# Altium schematic sheet Power.SchDoc
size A; SheetNumber: 3; SheetTotal: 11
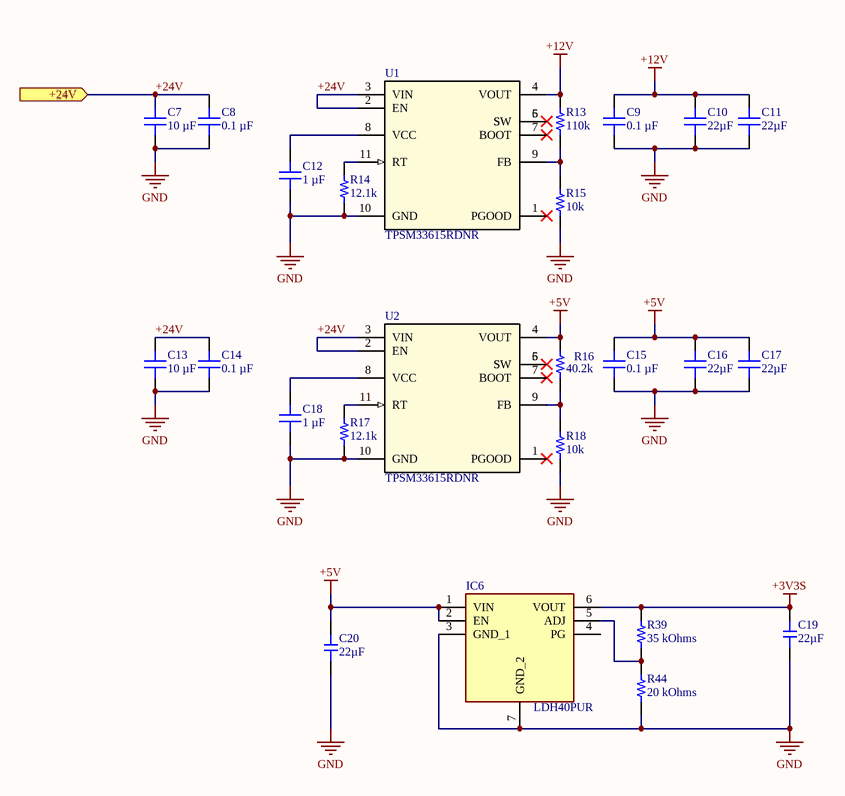
[diagram p0: Power.SchDoc]

## Parts
C7  10 µF  [CAP 1210_3225 - 1MM]
C8  0.1 µF  [CAP 0402_1005]
C9  0.1 µF  [CAP 0402_1005]
C10  22µF  [CAP 1210_3225 - 2.8MM]
C11  22µF  [CAP 1210_3225 - 2.8MM]
C12  1 µF  [CAP 0402_1005]
C13  10 µF  [CAP 1210_3225 - 1MM]
C14  0.1 µF  [CAP 0402_1005]
C15  0.1 µF  [CAP 0402_1005]
C16  22µF  [CAP 1210_3225 - 2.8MM]
C17  22µF  [CAP 1210_3225 - 2.8MM]
C18  1 µF  [CAP 0402_1005]
C19  value 22µF  [CAP-0603]  (hidden comment: CL10A226MQ8NRNC)
C20  value 22µF  [CAP-0603]  (hidden comment: CL10A226MQ8NRNC)
IC6  LDH40PUR  [SON65P200X200X80-7N]
R13  110k  [RES 0402_1005]
R14  12.1k  [RES 0402_1005]
R15  10k  [RES 0402_1005]
R16  40.2k  [RES 0402_1005]
R17  12.1k  [RES 0402_1005]
R18  10k  [RES 0402_1005]
R39  35 kOhms  [RES 0402_1005]
R44  20 kOhms  [RES 0402_1005]
U1  TPSM33615RDNR  [RDN0011A-MFG]
U2  TPSM33615RDNR  [RDN0011A-MFG]

## Ports
+24V (in)

## Nets
+3V3S: C19.2 IC6.6(VOUT) R39.1
+5V: C15.2 C16.2 C17.2 C20.2 IC6.1(VIN) IC6.2(EN) R16.1 U2.4(VOUT)
+12V: C9.2 C10.2 C11.2 R13.1 U1.4(VOUT)
GND: C7.1 C8.1 C9.1 C10.1 C11.1 C12.1 C13.1 C14.1 C15.1 C16.1 C17.1 C18.1 C19.1 C20.1 IC6.3(GND_1) IC6.7(GND_2) R14.2 R15.2 R17.2 R18.2 R44.2 U1.10(GND) U2.10(GND)
+24V: C7.2 C8.2 C13.2 C14.2 U1.2(EN) U1.3(VIN) U2.2(EN) U2.3(VIN) ; port +24V
NetC12_2: C12.2 U1.8(VCC)
NetC18_2: C18.2 U2.8(VCC)
NetIC6_5: IC6.5(ADJ) R39.2 R44.1
NetR13_2: R13.2 R15.1 U1.9(FB)
NetR14_1: R14.1 U1.11(RT)
NetR16_2: R16.2 R18.1 U2.9(FB)
NetR17_1: R17.1 U2.11(RT)
NetU1_5: U1.5(SW) U1.6(SW)
NetU2_5: U2.5(SW) U2.6(SW)

Not connected (* = marked no-connect by the designer): IC6 4(PG); U1 1(PGOOD)* 7(BOOT)*; U2 1(PGOOD)* 7(BOOT)*

## Library data of the parts
C7 C13 = GCJ32EC71H106KA01L: CAP CER 10UF 50V X7S 1210; manufacturer: Murata Electronics; Tolerance: ±10%; Part Number: GCJ32EC71H106KA01L; Value: 10 µF; Applications: Automotive, Boardflex Sensitive; Capacitance: 10 µF; componentlink1description: Datasheet; componentlink1url: https://search.murata.co.jp/Ceramy/image/img/A01X/G101/ENG/GCJ32EC71H106KA01-01.pdf; componentlink2description: DigiKey Link; componentlink2url: https://www.digikey.com/en/products/detail/murata-electronics/GCJ32EC71H106KA01L/6606047; Device Package: 1210 (3225 Metric); Features: Soft Termination; lastupdated: 6/4/2024 7:21:07 PM; Lifecycle Status: Active; Minimum Order: 1; Mounting Type: Surface Mount, MLCC; Operating Temperature: -55°C ~ 125°C; Package / Case: 1210 (3225 Metric); packaging: TapeAndReel; partid: 23622; Part Status: Active; price: 0.32; Ratings: AEC-Q200; series: GCJ; Size / Dimension: 0.126" L x 0.098" W (3.20mm x 2.50mm); Supplier 1: DigiKey; Supplier Part Number 1: 490-14418-1-ND; Temperature Coefficient: X7S; Thickness (Max): 0.110" (2.80mm); Voltage - Rated: 50V
C8 C9 C14 C15 = C0402C104K4RECAUTO: CAP CER 0402 0.1UF 16V X7R 10%; manufacturer: KEMET; Part Number: C0402C104K4RECAUTO; Capacitance: 0.1 µF; Applications: Automotive, ESD Protection; componentlink1description: Datasheet; componentlink1url: https://api.kemet.com/component-edge/download/datasheet/C0402C104K4RECAUTO.pdf; componentlink2description: DigiKey Link; componentlink2url: https://www.digikey.com/en/products/detail/kemet/C0402C104K4RECAUTO/8563695; Device Package: 0402 (1005 Metric); lastupdated: 2/9/2024 8:04:38 PM; Lifecycle Status: Active; Minimum Order: 1; Mounting Type: Surface Mount, MLCC; Operating Temperature: -55°C ~ 125°C; Package / Case: 0402 (1005 Metric); packaging: TapeAndReel; partid: 1731; Part Status: Active; price: 0.01; Ratings: AEC-Q200; series: ESD SMD Auto X7R; Size / Dimension: 0.039" L x 0.020" W (1.00mm x 0.50mm); Supplier 1: DigiKey; Supplier Part Number 1: 399-17167-1-ND; Temperature Coefficient: X7R; Thickness (Max): 0.022" (0.55mm); Tolerance: ±10%; value: 0.1 µF; Voltage - Rated: 16V
C10 C11 C16 C17 = 12103D226MAT2A: CAP CER 22UF 25V X5R 1210; manufacturer: AVX Corporation; Tolerance: ±20%; Part Number: 12103D226MAT2A; Value: 22µF; Applications: General Purpose; Capacitance: 22µF; componentlink1description: Datasheet; componentlink1url: http://datasheets.avx.com/cx5r.pdf; componentlink2description: DigiKey Link; componentlink2url: http://digikey.com/product-detail/en/avx-corporation/12103D226MAT2A/478-5045-1-ND/1888256; Device Package: 1210 (3225 Metric); lastupdated: 9/2/2020 1:10:51 AM; Lifecycle Status: Active; Minimum Order: 1; Mounting Type: Surface Mount, MLCC; Operating Temperature: -55°C ~ 85°C; Package / Case: 1210 (3225 Metric); packaging: TapeAndReel; partid: 23827; Part Status: Active; price: 0.32; series: -; Size / Dimension: 0.126" L x 0.098" W (3.20mm x 2.50mm); Supplier 1: DigiKey; Supplier Part Number 1: 478-5045-1-ND; Temperature Coefficient: X5R; Thickness (Max): 0.110" (2.79mm); Voltage - Rated: 25V
C12 C18 = CL05A105KO5NNNC: CAP CER 1UF 16V X5R 0402; Part Number: C29266; manufacturer: Samsung Electro-Mechanics; Tolerance: ±10%; Capacitance: 1 µF; Applications: General Purpose; componentlink1description: Datasheet; componentlink1url: http://www.samsungsem.com/kr/support/product-search/mlcc/CL05A105KO5NNNC.jsp; componentlink2description: DigiKey Link; componentlink2url: https://www.digikey.com/en/products/detail/samsung-electro-mechanics/CL05A105KO5NNNC/3886725; Device Package: 0402 (1005 Metric); lastupdated: 2/9/2024 8:04:35 PM; Lifecycle Status: Active; Minimum Order: 1; Mounting Type: Surface Mount, MLCC; Operating Temperature: -55°C ~ 85°C; Package / Case: 0402 (1005 Metric); packaging: TapeAndReel; partid: 3120; Part Status: Active; price: 0.01; series: CL; Size / Dimension: 0.039" L x 0.020" W (1.00mm x 0.50mm); Supplier 1: DigiKey; Supplier Part Number 1: 1276-1067-1-ND; Temperature Coefficient: X5R; Thickness (Max): 0.022" (0.55mm); value: 1 µF; Voltage - Rated: 16V
C19 C20 = CMP-001-00651-2: Capacitor, Ceramic (MLCC), 22uF, ±20%, 6.3V, X5R, ±20%, SMD 0603; Manufacturer: Samsung Electro-Mechanics; Impedance (0V Bias) @ 10kHz: 1.09Ω; Capacitance @ 1V DC Bias: 17.820uF; Capacitance @ 3.3V DC Bias: 8.834uF; Impedance (0V Bias) @ 500MHz: 0.428Ω; Impedance (0V Bias) @ 1kHz: 10.5Ω; Impedance (0V Bias) @ 500kHz: 0.0212Ω; Capacitance @ 1.8V DC Bias: 14.074uF; Impedance (0V Bias) @ 1MHz: 0.00751Ω; Impedance (0V Bias) @ 5kHz: 2.16Ω; Capacitance @ 1.5V DC Bias: 15.472uF; Impedance (0V Bias) @ 100MHz: 0.12Ω; Impedance (0V Bias) @ 100Hz: 100Ω; Impedance (0V Bias) @ 50kHz: 0.224Ω; Impedance (0V Bias) @ 5MHz: 0.0137Ω; Capacitance @ 5V DC Bias: 5.741uF; Impedance (0V Bias) @ 500Hz: 20.7Ω; Impedance (0V Bias) @ 5GHz: 3.43Ω; Capacitance @ 1.35V DC Bias: 16.197uF; Impedance (0V Bias) @ 10MHz: 0.0217Ω; Impedance (0V Bias) @ 2GHz: 1.72Ω; Capacitance @ 2.5V DC Bias: 11.369uF; Impedance (0V Bias) @ 50MHz: 0.0716Ω; Capacitance @ 1.2V DC Bias: 16.916uF; Impedance (0V Bias) @ 100kHz: 0.113Ω; Capacitance @ 4.2V DC Bias: 6.952uF; Capacitance @ 3.7V DC Bias: 7.897uF; Impedance (0V Bias) @ 1GHz: 0.751Ω; Temperature Rating: -55°C ~ 85°C; JLCPCB Basic Part: Yes; Temperature Coefficient: X5R; Tolerance: 20%; ComponentLink2Description: JLCPCB Part URL; ComponentLink1URL: https://wmsc.lcsc.com/wmsc/upload/file/pdf/v2/lcsc/2304140030_Samsung-Electro-Mechanics-CL10A226MQ8NRNC_C59461.pdf; ComponentLink4Description: Samsung Component Library; RoHS: Yes; Voltage Rating: 6.3V; ComponentLink4URL: https://weblib.samsungsem.com/mlcc/mlcc-ec.do?partNumber=CL10A226MQ8NRN; ComponentLink3Description: LCSC Part URL; ComponentLink2URL: https://jlcpcb.com/partdetail/C59461; Case/Package: 0603; Manufacturer Part Number: CL10A226MQ8NRNC; ComponentLink1Description: Datasheet; JLCPCB Part Number: C59461; ComponentLink3URL: https://lcsc.com/product-detail/Multilayer-Ceramic-Capacitors-MLCC---SMD-SMT_Samsung-Electro-Mechanics-Samsung-Electro-Mechanics-CL10A226MQ8NRNC_C59461.html; Design Item ID: CL10A226MQ8NRNC; Category: Capacitors - MLCC; Source: jlcpcb_2025_04_capacitors_basic.schlib
IC6 = LDH40PUR: Integrated Circuit; Manufacturer_Name: STMicroelectronics; Datasheet Link: https://www.st.com/resource/en/datasheet/ldh40.pdf; Height: 0.8mm; Manufacturer_Part_Number: LDH40PUR
R13 R16 = RQ73C1E10K5BTD: RES 10.5 KOHMS 0.1% 1/16W 0402; Part Number: C166559; Manufacturer: TE Connectivity Passive Product; Power (Watts): 0.063W, 1/16W; Resistance: 50k; Temperature Coefficient: ±10ppm/°C; ComponentLink1Description: Datasheet; ComponentLink1URL: //media.digikey.com/pdf/Data%20Sheets/Tyco%20Electronics%20P%20B%20PDFs/RQ73-0618%20v2.pdf; ComponentLink2Description: DigiKey Link; ComponentLink2URL: https://www.digikey.com/en/products/detail/te-connectivity-passive-product/RQ73C1E10K5BTD/9479898; Composition: Thin Film; Device Package: 0402 (1005 Metric); Features: Anti-Sulfur, Automotive AEC-Q200; Height - Seated (Max): 0.016" (0.40mm); LastUpdated: 2/9/2024 8:30:17 PM; Lifecycle Status: Active; Minimum Order: 1; Number of Terminations: 2; Operating Temperature: -55°C ~ 155°C; Package / Case: 0402 (1005 Metric); Packaging: TapeAndReel; PartId: 4287; Part Status: Active; Price: 0.27; Ratings: AEC-Q200; Series: RQ73; Size / Dimension: 0.039" L x 0.020" W (1.00mm x 0.50mm); Supplier 1: DigiKey; Supplier Part Number 1: A139950CT-ND; Supplier Device Package: 0402; Tolerance: ±0.1%
  R13: Value: 110k
  R16: Value: 40.2k
R14 R17 = RQ73C1E10K5BTD: RES 10.5 KOHMS 0.1% 1/16W 0402; Part Number: C132157; Manufacturer: TE Connectivity Passive Product; Power (Watts): 0.063W, 1/16W; Temperature Coefficient: ±10ppm/°C; Value: 12.1k; ComponentLink1Description: Datasheet; ComponentLink1URL: //media.digikey.com/pdf/Data%20Sheets/Tyco%20Electronics%20P%20B%20PDFs/RQ73-0618%20v2.pdf; ComponentLink2Description: DigiKey Link; ComponentLink2URL: https://www.digikey.com/en/products/detail/te-connectivity-passive-product/RQ73C1E10K5BTD/9479898; Composition: Thin Film; Device Package: 0402 (1005 Metric); Features: Anti-Sulfur, Automotive AEC-Q200; Height - Seated (Max): 0.016" (0.40mm); LastUpdated: 2/9/2024 8:30:17 PM; Lifecycle Status: Active; Minimum Order: 1; Number of Terminations: 2; Operating Temperature: -55°C ~ 155°C; Package / Case: 0402 (1005 Metric); Packaging: TapeAndReel; PartId: 4287; Part Status: Active; Price: 0.27; Ratings: AEC-Q200; Resistance: 12.1k; Series: RQ73; Size / Dimension: 0.039" L x 0.020" W (1.00mm x 0.50mm); Supplier 1: DigiKey; Supplier Part Number 1: A139950CT-ND; Supplier Device Package: 0402; Tolerance: ±0.1%
R15 R18 = RQ73C1E10K5BTD: RES 10.5 KOHMS 0.1% 1/16W 0402; Part Number: C25744; Manufacturer: TE Connectivity Passive Product; Power (Watts): 0.063W, 1/16W; Temperature Coefficient: ±10ppm/°C; Value: 10k; ComponentLink1Description: Datasheet; ComponentLink1URL: //media.digikey.com/pdf/Data%20Sheets/Tyco%20Electronics%20P%20B%20PDFs/RQ73-0618%20v2.pdf; ComponentLink2Description: DigiKey Link; ComponentLink2URL: https://www.digikey.com/en/products/detail/te-connectivity-passive-product/RQ73C1E10K5BTD/9479898; Composition: Thin Film; Device Package: 0402 (1005 Metric); Features: Anti-Sulfur, Automotive AEC-Q200; Height - Seated (Max): 0.016" (0.40mm); LastUpdated: 2/9/2024 8:30:17 PM; Lifecycle Status: Active; Minimum Order: 1; Number of Terminations: 2; Operating Temperature: -55°C ~ 155°C; Package / Case: 0402 (1005 Metric); Packaging: TapeAndReel; PartId: 4287; Part Status: Active; Price: 0.27; Ratings: AEC-Q200; Resistance: 10k; Series: RQ73; Size / Dimension: 0.039" L x 0.020" W (1.00mm x 0.50mm); Supplier 1: DigiKey; Supplier Part Number 1: A139950CT-ND; Supplier Device Package: 0402; Tolerance: ±0.1%
R39 R44 = WR04X102 JTL: RES 1K OHM 5% 1/16W 0402; Manufacturer: Walsin Technology Corporation; Power (Watts): 0.063W, 1/16W; Resistance: 1 kOhms; Temperature Coefficient: ±100ppm/°C; Part Number: WR04X102 JTL; ComponentLink1Description: Datasheet; ComponentLink1URL: https://www.passivecomponent.com/wp-content/uploads/chipR/ASC_WR.pdf; ComponentLink2Description: DigiKey Link; ComponentLink2URL: https://www.digikey.com/en/products/detail/walsin-technology-corporation/WR04X102-JTL/13238927; Composition: Thick Film; Device Package: 0402 (1005 Metric); Height - Seated (Max): 0.016" (0.40mm); LastUpdated: 2/9/2024 8:28:50 PM; Lifecycle Status: Active; Minimum Order: 1; Number of Terminations: 2; Operating Temperature: -55°C ~ 155°C; Package / Case: 0402 (1005 Metric); Packaging: CutTape; PartId: 68140; Part Status: Active; Price: 0.01; Series: WR; Size / Dimension: 0.039" L x 0.020" W (1.00mm x 0.50mm); Supplier 1: DigiKey; Supplier Part Number 1: 1292-WR04X102JTLCT-ND; Supplier Device Package: 0402; Tolerance: ±5%
  R39: Value: 35 kOhms
  R44: Value: 20 kOhms
U1 U2 = TPSM33615RDNR: No Description Available; Mfr_Name: Texas Instruments; TYPE: TYPE; RefDes: RefDes